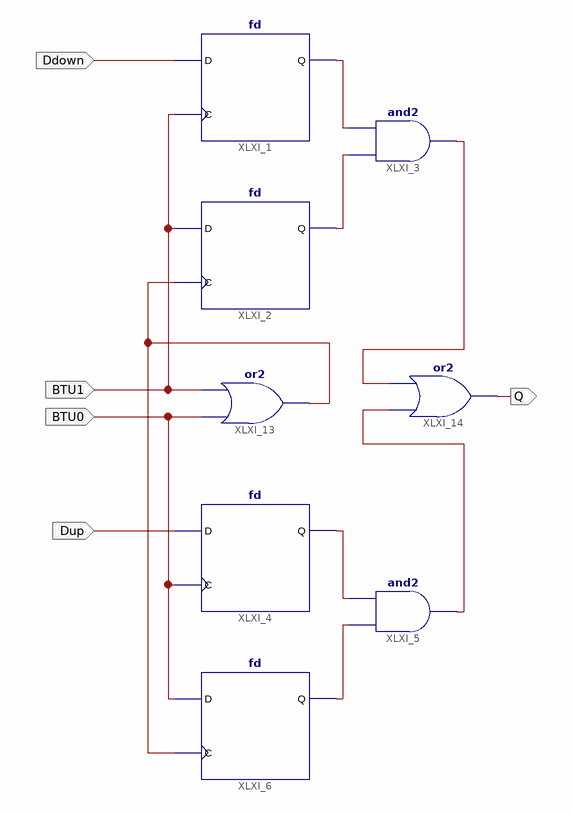
[diagram p0: schematic sheet 1]
// Xilinx ISE schematic bitcollector.sch (spartan3) as structural Verilog: 8 symbols, 5 ports
module bitcollector (
  input  Ddown,
  input  BTU1,
  input  Dup,
  input  BTU0,
  output Q
);

  wire clock, XLXN_5, XLXN_6, XLXN_9, XLXN_11, XLXN_29, XLXN_30;

  fd XLXI_1 (.C(BTU1), .D(Ddown), .Q(XLXN_5));
  and XLXI_3 (XLXN_29, XLXN_6, XLXN_5);
  fd XLXI_2 (.C(clock), .D(BTU1), .Q(XLXN_6));
  fd XLXI_4 (.C(BTU0), .D(Dup), .Q(XLXN_9));
  and XLXI_5 (XLXN_30, XLXN_11, XLXN_9);
  fd XLXI_6 (.C(clock), .D(BTU0), .Q(XLXN_11));
  or XLXI_13 (clock, BTU0, BTU1);
  or XLXI_14 (Q, XLXN_30, XLXN_29);
endmodule
